# EasyEDA schematic Sheet_1.json
TITLE: Sheet_2; REV: 1.0; Date: 2022-06-15; Sheet: 1/1; Drawn By: sszb; Company: Your Company
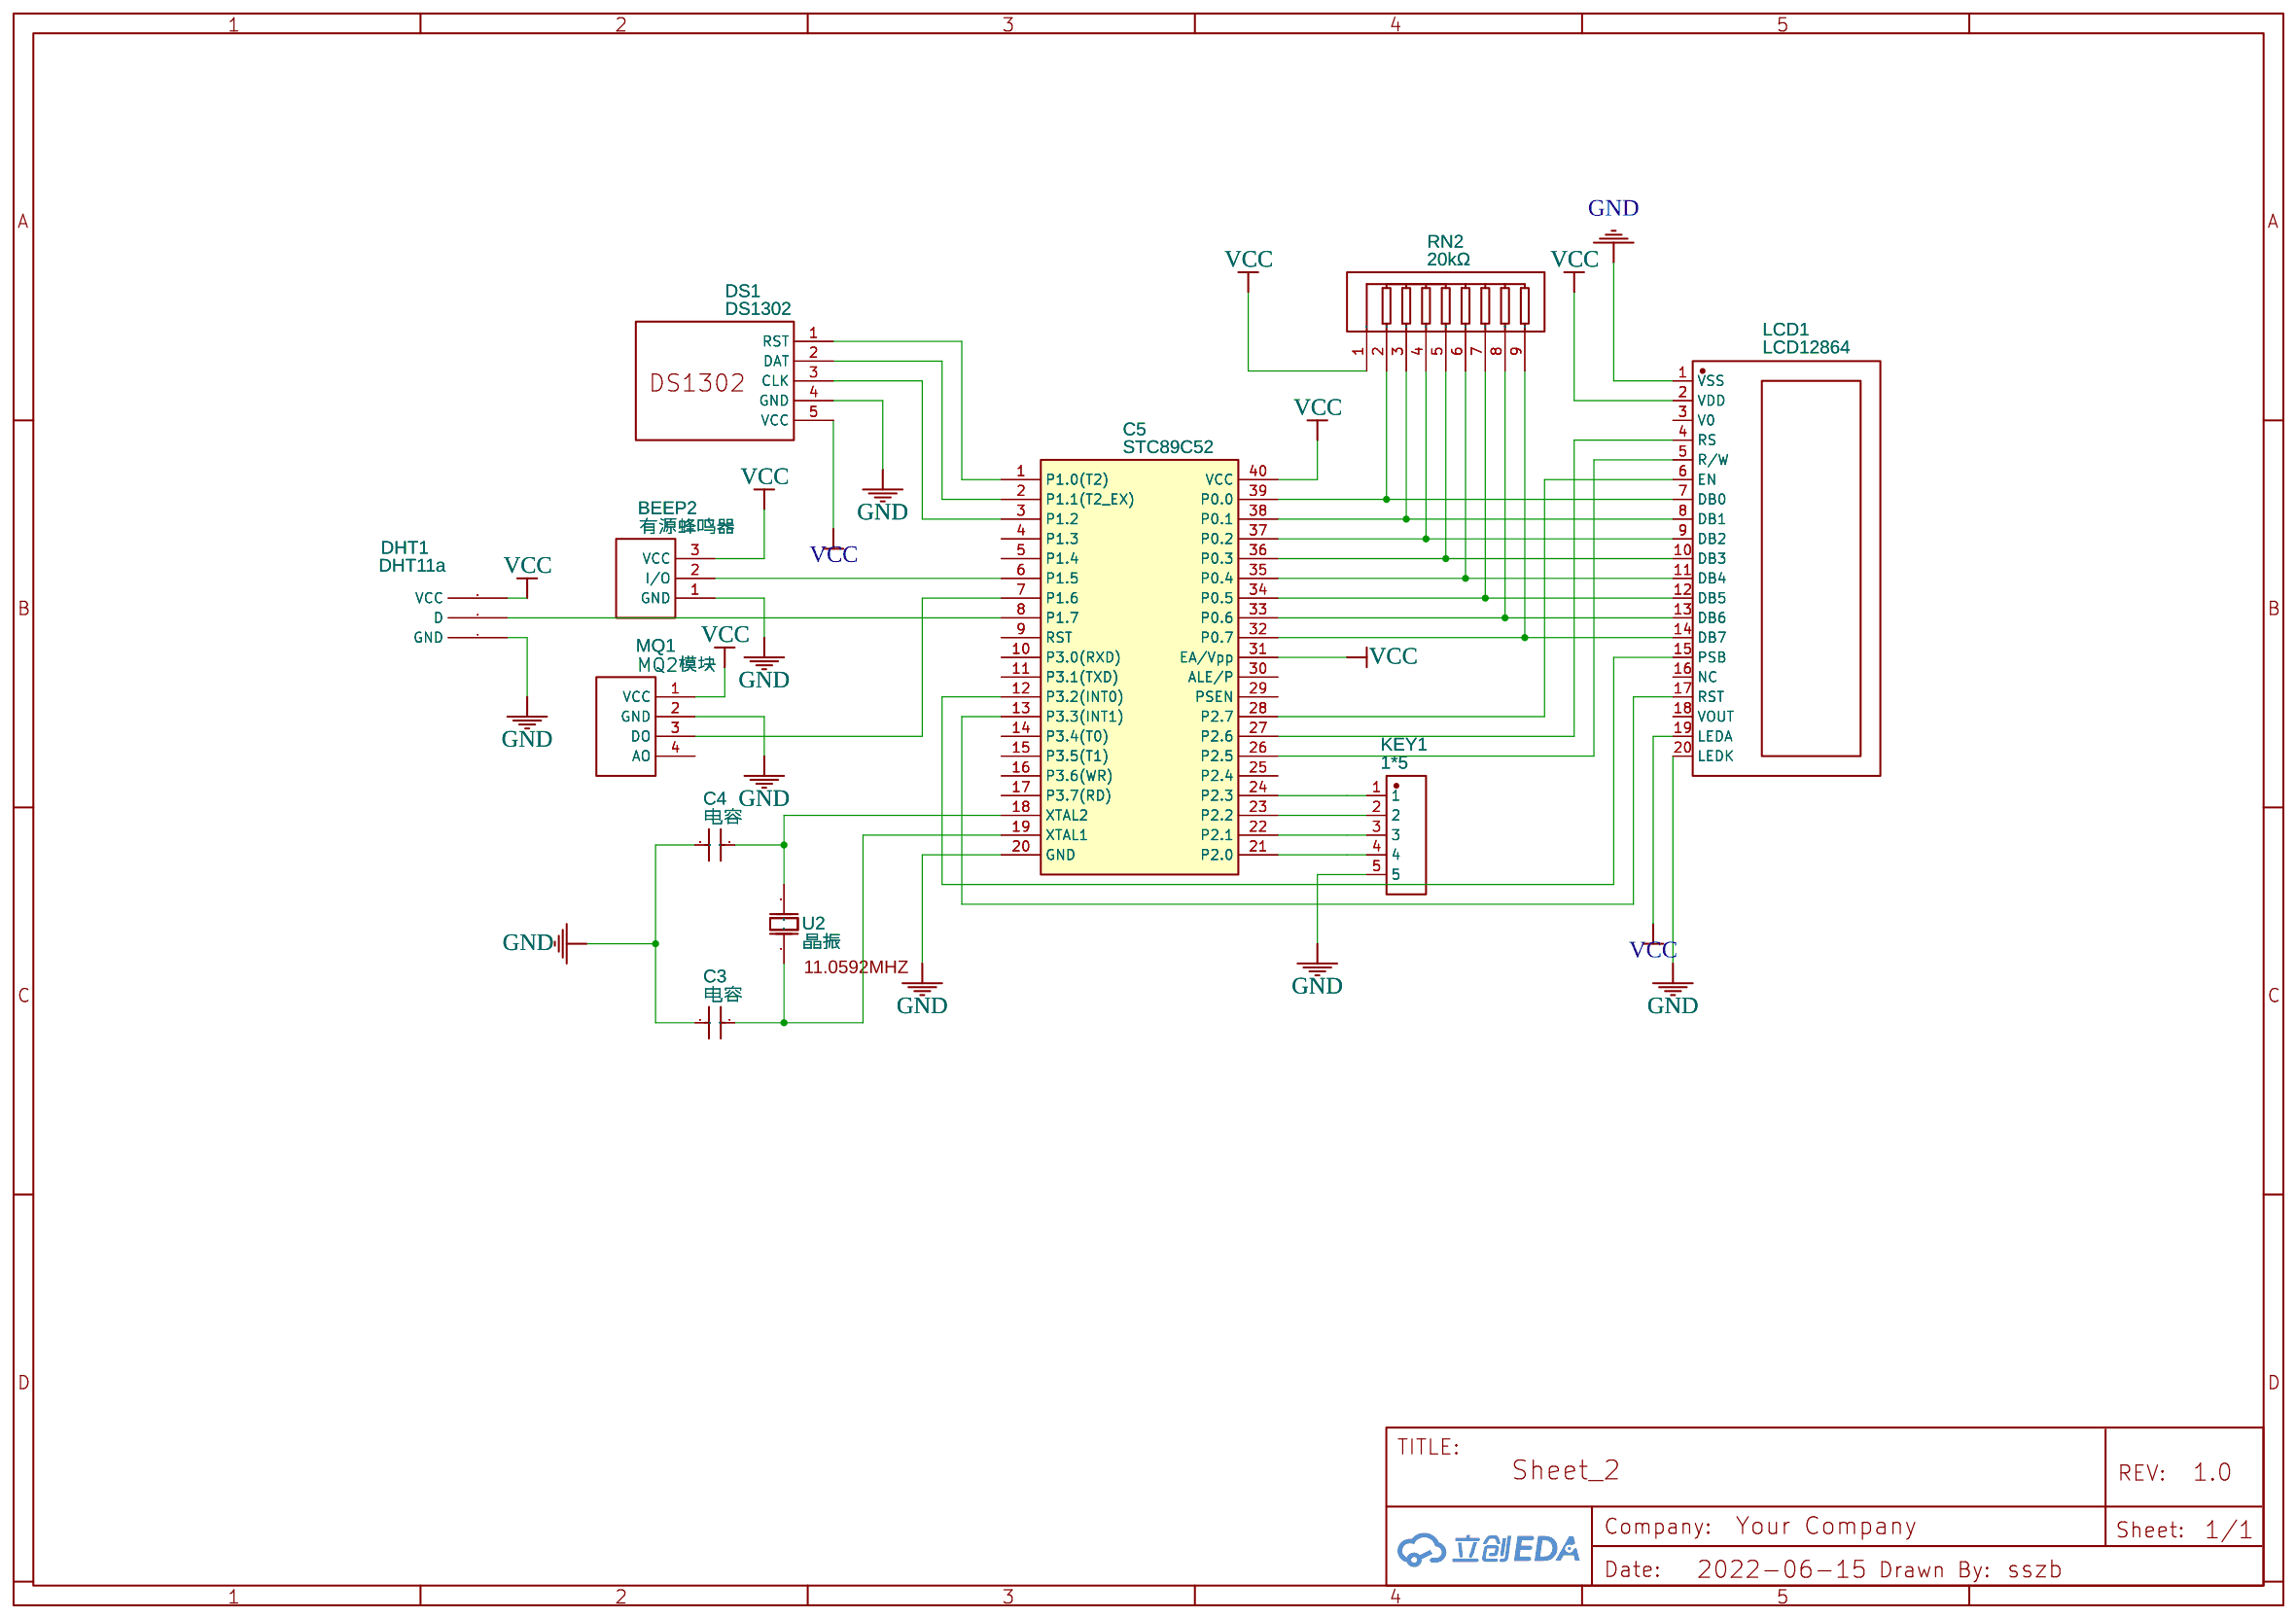
[diagram p0: schematic sheet]

## Parts
BEEP2  有源蜂鸣器  [有源蜂鸣器]
C3  电容  [C0.254]
C4  电容  [C0.254]
C5  STC89C52  [89C51DIP-40]
DHT1  DHT11a  [温湿度传感器DHT11A]
DS1  DS1302  [DS1302]
KEY1  1*5  [1*5]
LCD1  LCD12864  [LCD12864]
MQ1  MQ2模块  [MQ2模块]
RN2  20kΩ  [RES-ARRAY-TH_9P-P2.54-D1.0]
U2  晶振  [11.0592M插脚晶振]

## Library data of the parts
BEEP2 = 有源蜂鸣器: Supplier: EasyEDA; Contributor: dududu123
C3 C4 = 电容
C5 = STC89C52: Contributor: erhuoyan
DHT1 = 温湿度传感器DHT11a: Manufacturer Part: 模块DHT11开关模块模块DHT11度温湿湿度度传感器模块温湿; Contributor: 302PMY; Supplier: EasyEDA; link: https://item.taobao.com/item.htm?spm=a230r.1.14.61.561542fckYbuS5&id=600864194963&ns=1&abbucket=12#detail
DS1 = DS1302: Contributor: dhx233
KEY1 = 1*5: Contributor: Mr.fangyuan
LCD1 = LCD12864: Contributor: liangyanjie
MQ1 = MQ2模块: Contributor: hyc1245
RN2 = 排阻: Supplier: LCSC; Manufacturer: FH; Manufacturer Part: A09-203JP; Supplier Part: C30847; Resistance (Ohms): 20K; JLCPCB Part Class: Extended Part; Contributor: czy1714
U2 = 晶振: Contributor: BenzeneBaby

## Nets
GND: BEEP2.1(GND) C3.1 C4.1 C5.20(GND) DHT1.1(GND) DS1.4(GND) KEY1.5 LCD1.1(VSS) LCD1.20(LEDK) MQ1.2(GND)
VCC: BEEP2.3(VCC) C5.31(EA/Vpp) C5.40(VCC) DHT1.3(VCC) DS1.5(VCC) LCD1.2(VDD) LCD1.19(LEDA) MQ1.1(VCC) RN2.1
Net-(BEEP2-2): BEEP2.2(I/O) C5.6(P1.5)
Net-(C3-2): C3.2 C5.19(XTAL1) U2.2(OSC1)
Net-(C4-2): C4.2 C5.18(XTAL2) U2.1(OSC2)
Net-(C5-1): C5.1(P1.0(T2)) DS1.1(RST)
Net-(C5-2): C5.2(P1.1(T2 EX)) DS1.2(DAT)
Net-(C5-3): C5.3(P1.2) DS1.3(CLK)
Net-(C5-7): C5.7(P1.6) MQ1.3(DO)
Net-(C5-8): C5.8(P1.7) DHT1.2(D)
Net-(C5-12): C5.12(P3.2(INT0)) LCD1.15(PSB)
Net-(C5-13): C5.13(P3.3(INT1)) LCD1.17(RST)
Net-(C5-21): C5.21(P2.0) KEY1.4
Net-(C5-22): C5.22(P2.1) KEY1.3
Net-(C5-23): C5.23(P2.2) KEY1.2
Net-(C5-24): C5.24(P2.3) KEY1.1
Net-(C5-26): C5.26(P2.5) LCD1.5(R/W)
Net-(C5-27): C5.27(P2.6) LCD1.4(RS)
Net-(C5-28): C5.28(P2.7) LCD1.6(EN)
Net-(C5-32): C5.32(P0.7) LCD1.14(DB7) RN2.9
Net-(C5-33): C5.33(P0.6) LCD1.13(DB6) RN2.8
Net-(C5-34): C5.34(P0.5) LCD1.12(DB5) RN2.7
Net-(C5-35): C5.35(P0.4) LCD1.11(DB4) RN2.6
Net-(C5-36): C5.36(P0.3) LCD1.10(DB3) RN2.5
Net-(C5-37): C5.37(P0.2) LCD1.9(DB2) RN2.4
Net-(C5-38): C5.38(P0.1) LCD1.8(DB1) RN2.3
Net-(C5-39): C5.39(P0.0) LCD1.7(DB0) RN2.2

Not connected (* = marked no-connect by the designer): C5 4(P1.3) 5(P1.4) 9(RST) 10(P3.0(RXD)) 11(P3.1(TXD)) 14(P3.4(T0)) 15(P3.5(T1)) 16(P3.6(WR)) 17(P3.7(RD)) 25(P2.4) 29(PSEN) 30(ALE/P); LCD1 3(V0) 16(NC) 18(VOUT); MQ1 4(AO)
